# EAGLE design pca9554d-3 (EAGLE 7.7.0)
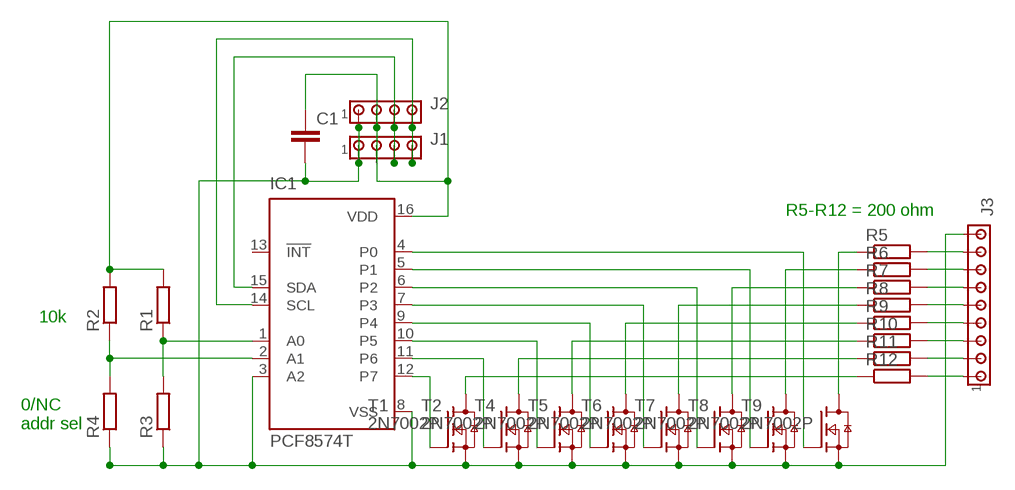
[diagram p0: schematic, sheet 1]

## Parts
C1  C-EUC1206  [C1206]
IC1  PCF8574T  [SO16W]
J1  MTA04-100  [10X04MTA]
J2  MTA04-100  [10X04MTA]
J3  MTA09-100  [10X09MTA]
R1  R-EU_R0805  [R0805]
R2  R-EU_R0805  [R0805]
R3  R-EU_R0402  [R0402]
R4  R-EU_R0402  [R0402]
R5  R-EU_R0805W  [R0805W]
R6  R-EU_R0805W  [R0805W]
R7  R-EU_R0805W  [R0805W]
R8  R-EU_R0805W  [R0805W]
R9  R-EU_R0805W  [R0805W]
R10  R-EU_R0805W  [R0805W]
R11  R-EU_R0805W  [R0805W]
R12  R-EU_R0805W  [R0805W]
T1  2N7002P  [SOT23]
T2  2N7002P  [SOT23]
T4  2N7002P  [SOT23]
T5  2N7002P  [SOT23]
T6  2N7002P  [SOT23]
T7  2N7002P  [SOT23]
T8  2N7002P  [SOT23]
T9  2N7002P  [SOT23]

## Nets
N$1: C1.1 IC1.16(VDD) J1.2 J2.2 R1.2 R2.2
N$2: J3.8 R5.2
N$3: IC1.15(SDA) J1.3 J2.3
N$4: IC1.14(SCL) J1.4 J2.4
N$5: IC1.1(A0) R1.1 R3.2
N$6: IC1.2(A1) R2.1 R4.2
N$7: IC1.12(P7) T1.1(G)
N$8: J3.7 R6.2
N$9: J3.6 R7.2
N$10: J3.5 R8.2
N$11: J3.4 R9.2
N$12: J3.3 R10.2
N$13: J3.2 R11.2
N$14: J3.1 R12.2
N$15: IC1.11(P6) T2.1(G)
N$16: C1.2 IC1.3(A2) IC1.8(VSS) J1.1 J2.1 J3.9 R3.1 R4.1 T1.2(S) T2.2(S) T4.2(S) T5.2(S) T6.2(S) T7.2(S) T8.2(S) T9.2(S)
N$17: IC1.10(P5) T4.1(G)
N$18: IC1.9(P4) T5.1(G)
N$19: IC1.7(P3) T6.1(G)
N$20: IC1.6(P2) T7.1(G)
N$21: IC1.5(P1) T8.1(G)
N$22: IC1.4(P0) T9.1(G)
N$23: R5.1 T9.3(D)
N$24: R6.1 T8.3(D)
N$25: R7.1 T7.3(D)
N$26: R8.1 T6.3(D)
N$27: R9.1 T5.3(D)
N$28: R10.1 T4.3(D)
N$29: R11.1 T2.3(D)
N$30: R12.1 T1.3(D)
Unconnected: IC1.13(!INT)

## Notes on the sheet
- R5-R12 = 200 ohm
- 10k
- 0/NC
  addr sel

## Library data of the parts
C1 = rcl:C-EU: CAPACITOR, European symbol
IC1 = micro-philips:PCF8574: I2C-Bus Remote 8-bit I/O expander http://www.semiconductors.philips.com/acrobat_download/datasheets/PCF8574_4.pdf; MPN: PCF8574T/3,512; OC_FARNELL: 1201255; OC_NEWARK: 70R6870
J1 J2 = con-amp:MTA04-100: AMP connector
J3 = con-amp:MTA09-100: AMP connector
R1 R2 R5-R12 = resistor:R-EU_: RESISTOR, European symbol
R3 R4 = rcl:R-EU_: RESISTOR, European symbol
T1 T2 T4-T9 = nxp_60:2N7002: N-channel TrenchMOS FET N-channel enhancement mode Field-Effect Transistor (FET) in a plastic package using TrenchMOS technology. AAL Eindhoven MK

## Board
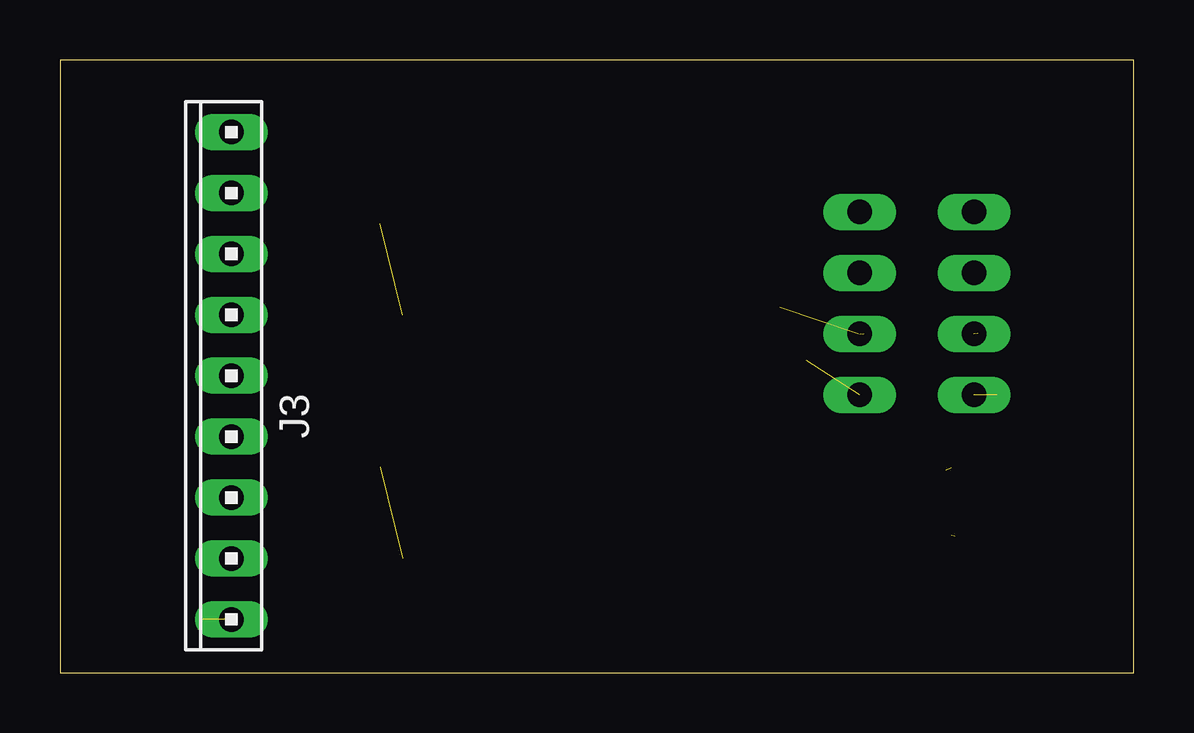
[diagram p1: board, top side]
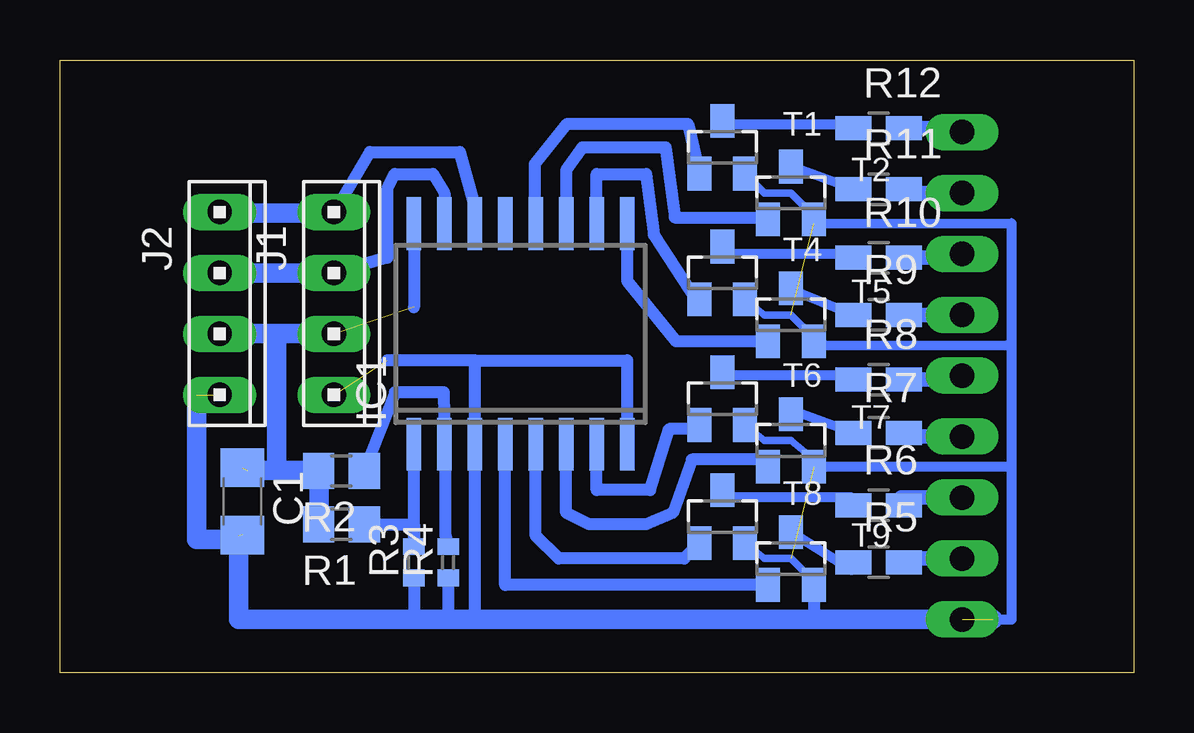
[diagram p2: board, bottom side, seen from below]

Size 44.76 x 25.55 mm. Coordinates in mm from the lower left corner, seen from the top.
Outline: 0,0 44.76,0 44.76,25.55 0,25.55 0,0
Copper layers (1*16): Top 0.035mm / dielectric 1.5mm / Bottom 0.035mm
Design rules "default": minimum track width 10mil, minimum drill 24mil, track to track 8mil, track to pad 8mil, pad to pad 8mil, via to via 8mil, smd to smd 8mil, copper to edge 40mil, drill to drill 8mil, minimum pad ring 10mil, minimum via ring 8mil, stop-mask expansion 4mil, vias tented up to drill 0mil, thermal gap 10mil

### Footprints (pad centres in the part's own frame; a part is rotated, then mirrored left to right if it is on the bottom)
C1206 = smd 1.6 x 1.8: 1 -1.4,0; 2 1.4,0
SO16W = smd 0.6 x 2.2: 1 -4.445,-4.6; 2 -3.175,-4.6; 3 -1.905,-4.6; 4 -0.635,-4.6; 5 0.635,-4.6; 6 1.905,-4.6; 7 3.175,-4.6; 8 4.445,-4.6; 9 4.445,4.6; 10 3.175,4.6; 11 1.905,4.6; 12 0.635,4.6; 13 -0.635,4.6; 14 -1.905,4.6; 15 -3.175,4.6; 16 -4.445,4.6
10X04MTA = drill 1.016 long: 1 3.81,0; 2 1.27,0; 3 -1.27,0; 4 -3.81,0
10X09MTA = drill 1.016 long: 1 10.16,0; 2 7.62,0; 3 5.08,0; 4 2.54,0; 5 0,0; 6 -2.54,0; 7 -5.08,0; 8 -7.62,0; 9 -10.16,0
R0805 = smd 1.3 x 1.5: 1 -0.95,0; 2 0.95,0
R0402 = smd 0.7 x 0.9: 1 -0.65,0; 2 0.65,0
R0805W = smd 1.5 x 1: 1 -1.052,0; 2 1.052,0
SOT23 = smd 1 x 1.4: 1 -0.95,-1.1; 2 0.95,-1.1; 3 0,1.1

### Placement (x,y rotation side)
C1  37.15,7.14 270 bottom
IC1  25.56,14.13 0 bottom
J1  33.34,15.4 270 bottom
J2  38.1,15.4 270 bottom
J3  7.14,12.38 90 top
R1  33.02,6.19 180 bottom
R2  33.02,8.41 180 bottom
R3  30,4.6 90 bottom
R4  28.57,4.6 90 bottom
R5  10.64,4.6 0 bottom
R6  10.64,6.99 0 bottom
R7  10.64,10 0 bottom
R8  10.64,12.22 0 bottom
R9  10.64,14.92 0 bottom
R10  10.64,17.3 0 bottom
R11  10.64,20.16 0 bottom
R12  10.64,22.7 0 bottom
T1  17.14,21.91 0 bottom
T2  14.29,20 0 bottom
T4  17.14,16.67 0 bottom
T5  14.29,14.92 0 bottom
T6  17.14,11.43 0 bottom
T7  14.29,9.68 0 bottom
T8  17.14,6.51 0 bottom
T9  14.29,4.76 0 bottom

### Tracks (layer width: path | path; a pad name or v marks a point on that pad's centre or on a via)
N$1  (4 unrouted)
  Bottom 0.254: 33.27,14.14 J1.2 | 33.96,6.37 R1.2 | 33.96,8.2 R2.2 34.19,8.43
  Bottom 0.508: IC1.16 30,15.24
  Bottom 0.813: 33.96,8.2 33.96,6.37 | 34.19,8.43 35.72,8.43 | 35.72,8.43 36.93,8.43 | 33.5,14.14 35.72,14.14 | 35.72,14.14 38.25,14.14 | 35.72,14.14 35.72,8.43
N$2
  Bottom 0.61: J3.8 9.43,4.76 arc-90 R5.2
N$3
  Bottom 0.254: 28.86,18.83 IC1.15 | 38.25,16.66 J2.3 | 33.5,16.66 J1.3
  Bottom 0.508: IC1.15 28.73,20 29.21,20.8 30.8,20.8 31.11,20.16 31.11,17.3 J1.3
  Bottom 0.813: 33.5,16.66 38.25,16.66
N$4
  Bottom 0.254: 27.49,19.51 27.49,18.83 IC1.14 | 38.25,19.17 J2.4 | 33.5,19.17 J1.4
  Bottom 0.508: 27.49,19.51 28.1,21.71 31.84,21.71 J1.4
  Bottom 0.813: 33.5,19.17 38.25,19.17
N$5
  Bottom 0.508: R1.1 30,6.19 R3.2 IC1.1
N$6
  Bottom 0.254: 28.7,9.73 28.86,9.68 IC1.2
  Bottom 0.508: R2.1 30.79,11.69 28.75,11.69 28.7,9.73 28.7,5.78 R4.2
N$7
  Bottom 0.254: 24.96,18.79 IC1.12
  Bottom 0.508: 24.96,18.79 24.96,21.22 23.61,22.89 18.58,22.89 T1.1
N$8
  Bottom 0.61: R6.2 9.68,6.99 9.68,7.3 J3.7
N$9
  Bottom 0.61: J3.6 9.43,9.84 arc90 R7.2
N$10
  Bottom 0.61: R8.2 6.67,12.22 arc-90 J3.5
N$11
  Bottom 0.61: J3.4 9.43,14.92 arc90 R9.2
N$12
  Bottom 0.61: R10.2 6.67,17.3 arc-90 J3.3
N$13
  Bottom 0.61: R11.2 arc-90 9.27,20 J3.2
N$14
  Bottom 0.61: 9.68,22.7 R12.2 6.83,22.7 arc90 J3.1
N$15
  Bottom 0.254: 15.38,18.98 T2.1
  Bottom 0.508: 15.38,18.98 19.12,18.98 19.51,21.91 22.97,21.91 23.65,20.95 IC1.11
N$16  (6 unrouted)
  Bottom 0.254: 20.94,9.65 IC1.8 21.17,9.65 21.17,9.38 | T9.2 13.34,3.81 | 13.34,8.89 T7.2 13.35,8.74 13.02,8.57 | 13.34,13.97 T5.2 13.34,13.66 | 13.34,19.05 T2.2 13.02,18.9 13.34,18.73 | 13.34,2.54 14.13,2.22 | 27.49,9.68 27.49,10.37 IC1.3 27.49,9.68
  Bottom 0.305: 13.34,3.81 14.29,4.76 15.39,4.76 T8.2 | 13.34,8.89 14.29,9.68 15.39,9.68 T6.2 | 13.34,13.97 14.29,14.92 15.39,14.92 T4.2 | 13.34,19.05 14.29,20 15.39,20 T1.2
  Bottom 0.406: 13.34,13.66 12.86,13.65 5.27,13.66 | 13.34,18.73 5.08,18.74 | 5.08,18.74 5.09,18.74 | 5.24,8.57 13.02,8.57 | 37.31,5.71 38.26,5.56 | 5.87,2.22 5.08,2.22 5.08,18.74
  Bottom 0.508: 27.46,2.22 IC1.3 27.46,13.02 | T9.2 13.34,2.54 | 27.46,13.02 21.11,13.02 IC1.8 | R4.1 28.57,2.22 | R3.1 30,2.22 | 27.46,13.02 31.11,13.02
  Bottom 0.813: 39.05,11.59 39.05,5.56 38.26,5.56 37.15,5.56 | 5.87,2.22 14.13,2.22 27.46,2.22 28.57,2.22 30,2.22 37.31,2.22 37.31,5.71
N$17
  Bottom 0.254: 18.25,15.55 T4.1
  Bottom 0.508: IC1.10 22.38,20.8 20.32,20.8 20,18.26 18.25,15.55
N$18
  Bottom 0.254: 19.05,13.81 19.06,13.82
  Bottom 0.508: IC1.9 21.11,16.35 19.05,13.81 | 19.06,13.82 T5.1
N$19
  Bottom 0.254: 18.26,10.15 18.42,10.29 T6.1
  Bottom 0.508: 18.26,10.15 19.37,10.16 20.16,7.62 22.38,7.62 IC1.7
N$20
  Bottom 0.508: T7.1 15.38,8.89 18.41,8.89 19.21,6.67 20.32,6.19 22.7,6.19 23.65,6.67 IC1.6
N$21
  Bottom 0.508: T8.1 18.74,4.76 23.97,4.76 24.92,5.71 IC1.5
N$22
  Bottom 0.508: T9.1 26.19,3.66 IC1.4
N$23
  Bottom 0.254: R5.1 11.76,4.29
  Bottom 0.406: 11.76,4.29 T9.3
N$24
  Bottom 0.254: 17.32,7.3 T8.3
  Bottom 0.406: R6.1 11.75,6.99 11.75,7.3 17.32,7.3
N$25
  Bottom 0.406: R7.1 14.3,10.95 T7.3
N$26
  Bottom 0.254: 17,12.38 T6.3
  Bottom 0.406: R8.1 11.91,12.22 11.91,12.38 17,12.38
N$27
  Bottom 0.406: R9.1 14.46,16.03 T5.3
N$28
  Bottom 0.254: 17.16,17.46 T4.3
  Bottom 0.406: R10.1 11.91,17.3 11.91,17.46 17.16,17.46
N$29
  Bottom 0.406: R11.1 14.3,21.11 T2.3
N$30
  Bottom 0.254: 17.32,22.86 T1.3
  Bottom 0.406: R12.1 11.75,22.7 11.75,22.86 17.32,22.86